# EAGLE design litebrite2.2 (EAGLE 6.5.0)
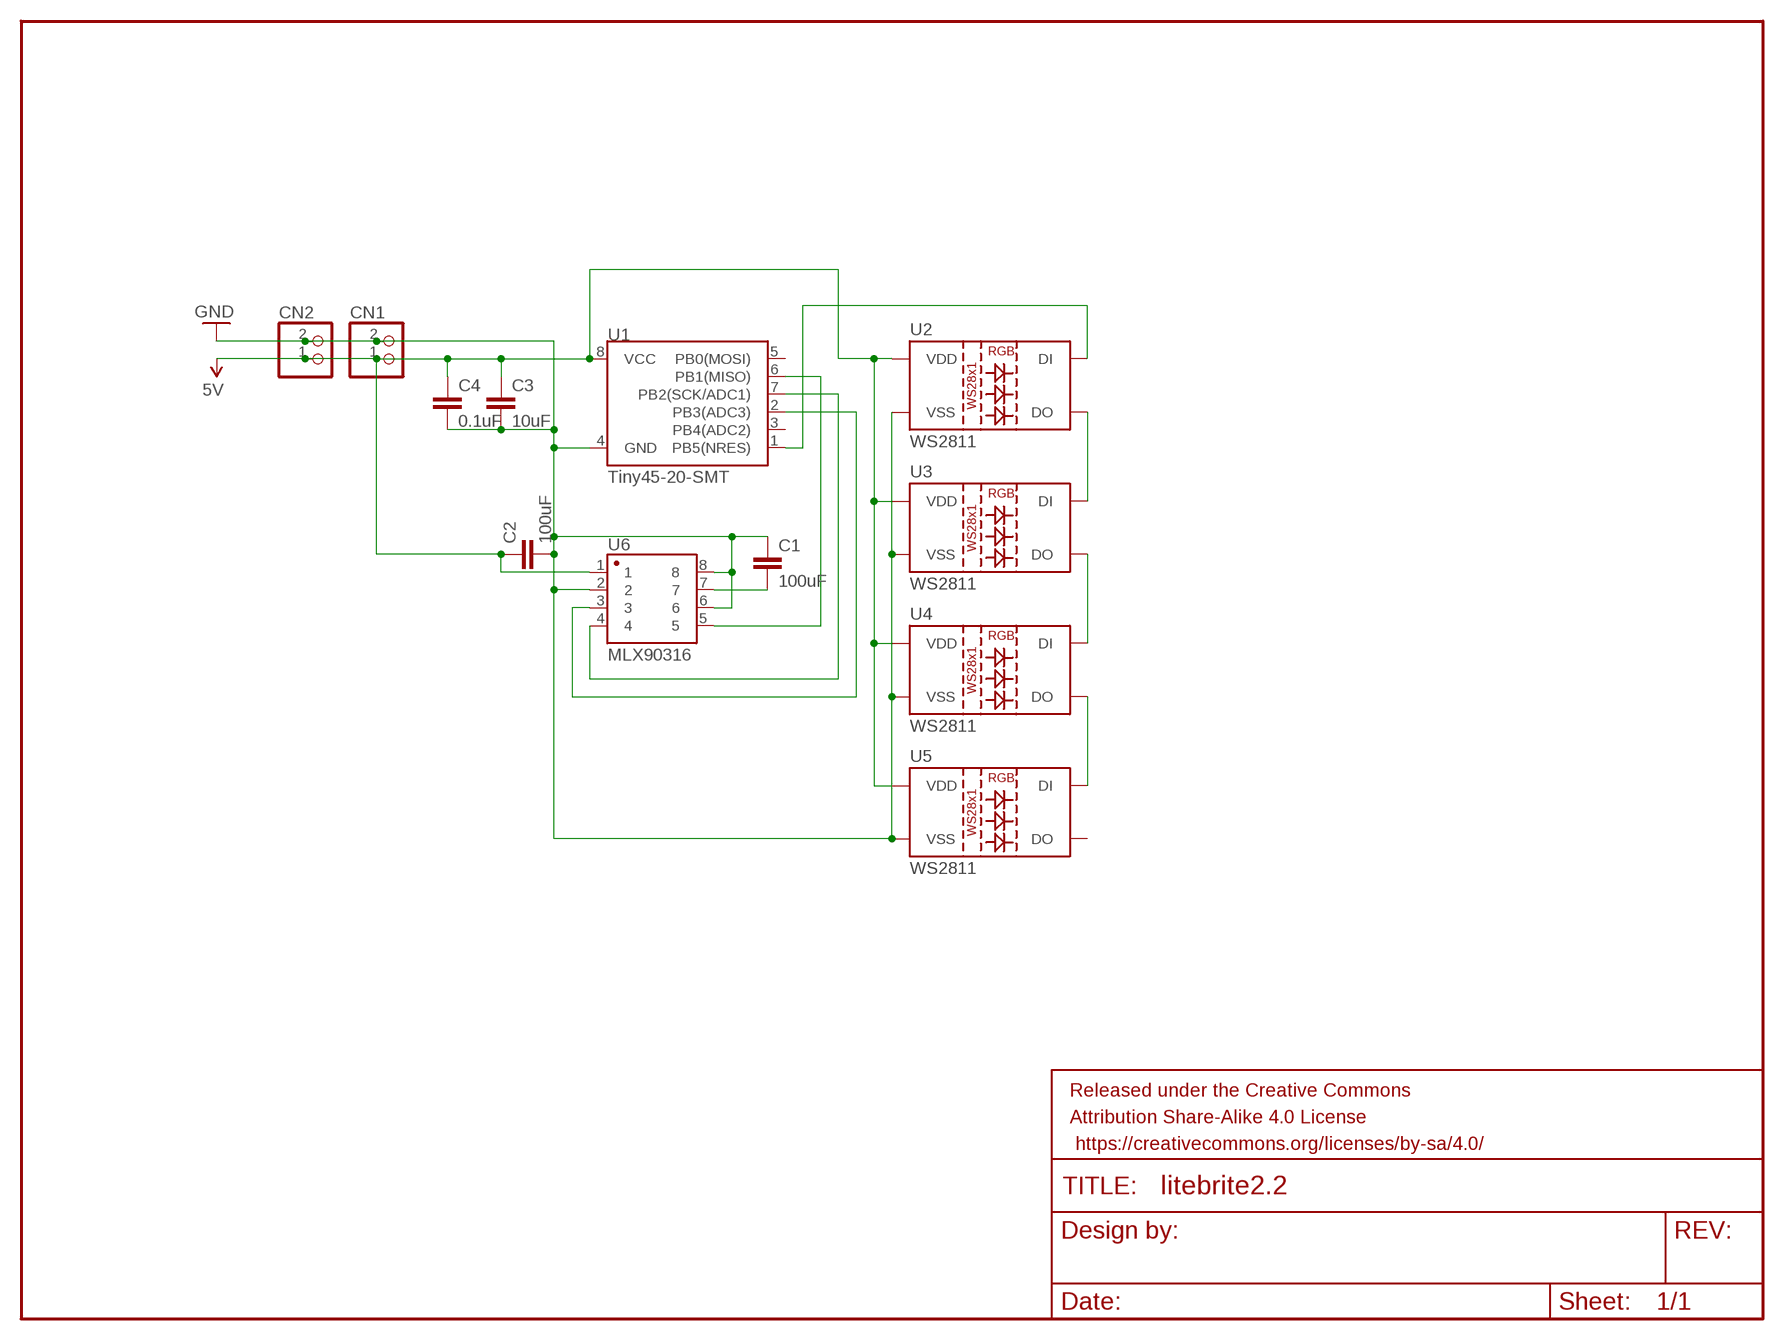
[diagram p0: schematic, sheet 1]

## Parts
C1  100uF  100UF6.3V20%(1210)  [1210]
C2  100uF  100UF6.3V20%(1210)  [1210]
C3  10uF  10UF-6.3V-20%(1206)  [1206]
C4  0.1uF  0.1UF-16V(+-10%)(0402)  [0402-CAP]
CN1  JST_2PIN-SMT-RA  [JST-PH-2-SMT-RA]
CN2  JST_2PIN-SMT-RA  [JST-PH-2-SMT-RA]
FRAME1  FRAME-LETTERNO_PACKAGE  [DUMMY]
U1  Tiny45-20-SMT  ATTINY45TINY45-20-SMT  [SO08-EIAJ]
U2  WS2811  LED-TRICOLOR-5050-ICWS2811  [LED-TRICOLOR-5050-IC]
U3  WS2811  LED-TRICOLOR-5050-ICWS2811  [LED-TRICOLOR-5050-IC]
U4  WS2811  LED-TRICOLOR-5050-ICWS2811  [LED-TRICOLOR-5050-IC]
U5  WS2811  LED-TRICOLOR-5050-ICWS2811  [LED-TRICOLOR-5050-IC]
U6  MLX90316  GENERIC-SOIC8MSGEQ7N-FILTER  [SO08]

## Nets
5V: C2.1 C3.1 C4.1 CN1.1 CN2.1 U1.8(VCC) U2.3(VDD) U2.5(VDD) U3.3(VDD) U3.5(VDD) U4.3(VDD) U4.5(VDD) U5.3(VDD) U5.5(VDD) U6.1
GND: C1.1 C2.2 C3.2 C4.2 CN1.2 CN2.2 U1.4(GND) U2.6(VSS) U3.6(VSS) U4.6(VSS) U5.6(VSS) U6.2 U6.6 U6.8
N$1: U2.1(DO) U3.2(DI)
N$2: U3.1(DO) U4.2(DI)
N$3: U4.1(DO) U5.2(DI)
N$4: U1.1(PB5(NRES)) U2.2(DI)
N$5: C1.2 U6.7
N$6: U1.6(PB1(MISO)) U6.5
N$7: U1.7(PB2(SCK/ADC1)) U6.4
N$8: U1.2(PB3(ADC3)) U6.3
Unconnected: U1.3(PB4(ADC2)) U1.5(PB0(MOSI)) U5.1(DO)

## Library data of the parts
C1 C2 = SparkFun-Capacitors:100UF6.3V20%(1210): CAP-09827; PROD_ID: CAP-09827
C3 = SparkFun-Capacitors:10UF-6.3V-20%(1206): CAP-10057 Ceramic; PROD_ID: CAP-10057
C4 = SparkFun-Capacitors:0.1UF-16V(+-10%)(0402); PROD_ID: CAP-12416
CN1 CN2 = adafruit:JST_2PIN: JST 2-Pin Connectors of various flavors SMT-RA (S2B-PH-SM4) 4UConnector #17311 SMT (B2B-PH-SM4) THM-RA (S2B-PH) THM (B2B-PH)
FRAME1 = SparkFun-Aesthetics:FRAME-LETTER: Schematic Frame Standard 8.5x11 US Letter frame; DESIGNER: Nobody; VERSION: v01
U1 = SparkFun-DigitalIC:ATTINY45: Atmel 8-pin 2/4/8kB flash uC; PROD_ID: IC-08922
U2-U5 = SparkFun-LED:LED-TRICOLOR-5050-IC: WS2812 RGB LED w/ WS2811 driver 5x5mm SMD LED with built-in controller IC. DIO-11598; PROD_ID: DIO-11598
U6 = SparkFun-AnalogIC:GENERIC-SOIC8: A placeholder for generic narrow & wide SOIC8 foorptints - used on the DIP adapter board.; PROD_ID: IC-10141

## Board
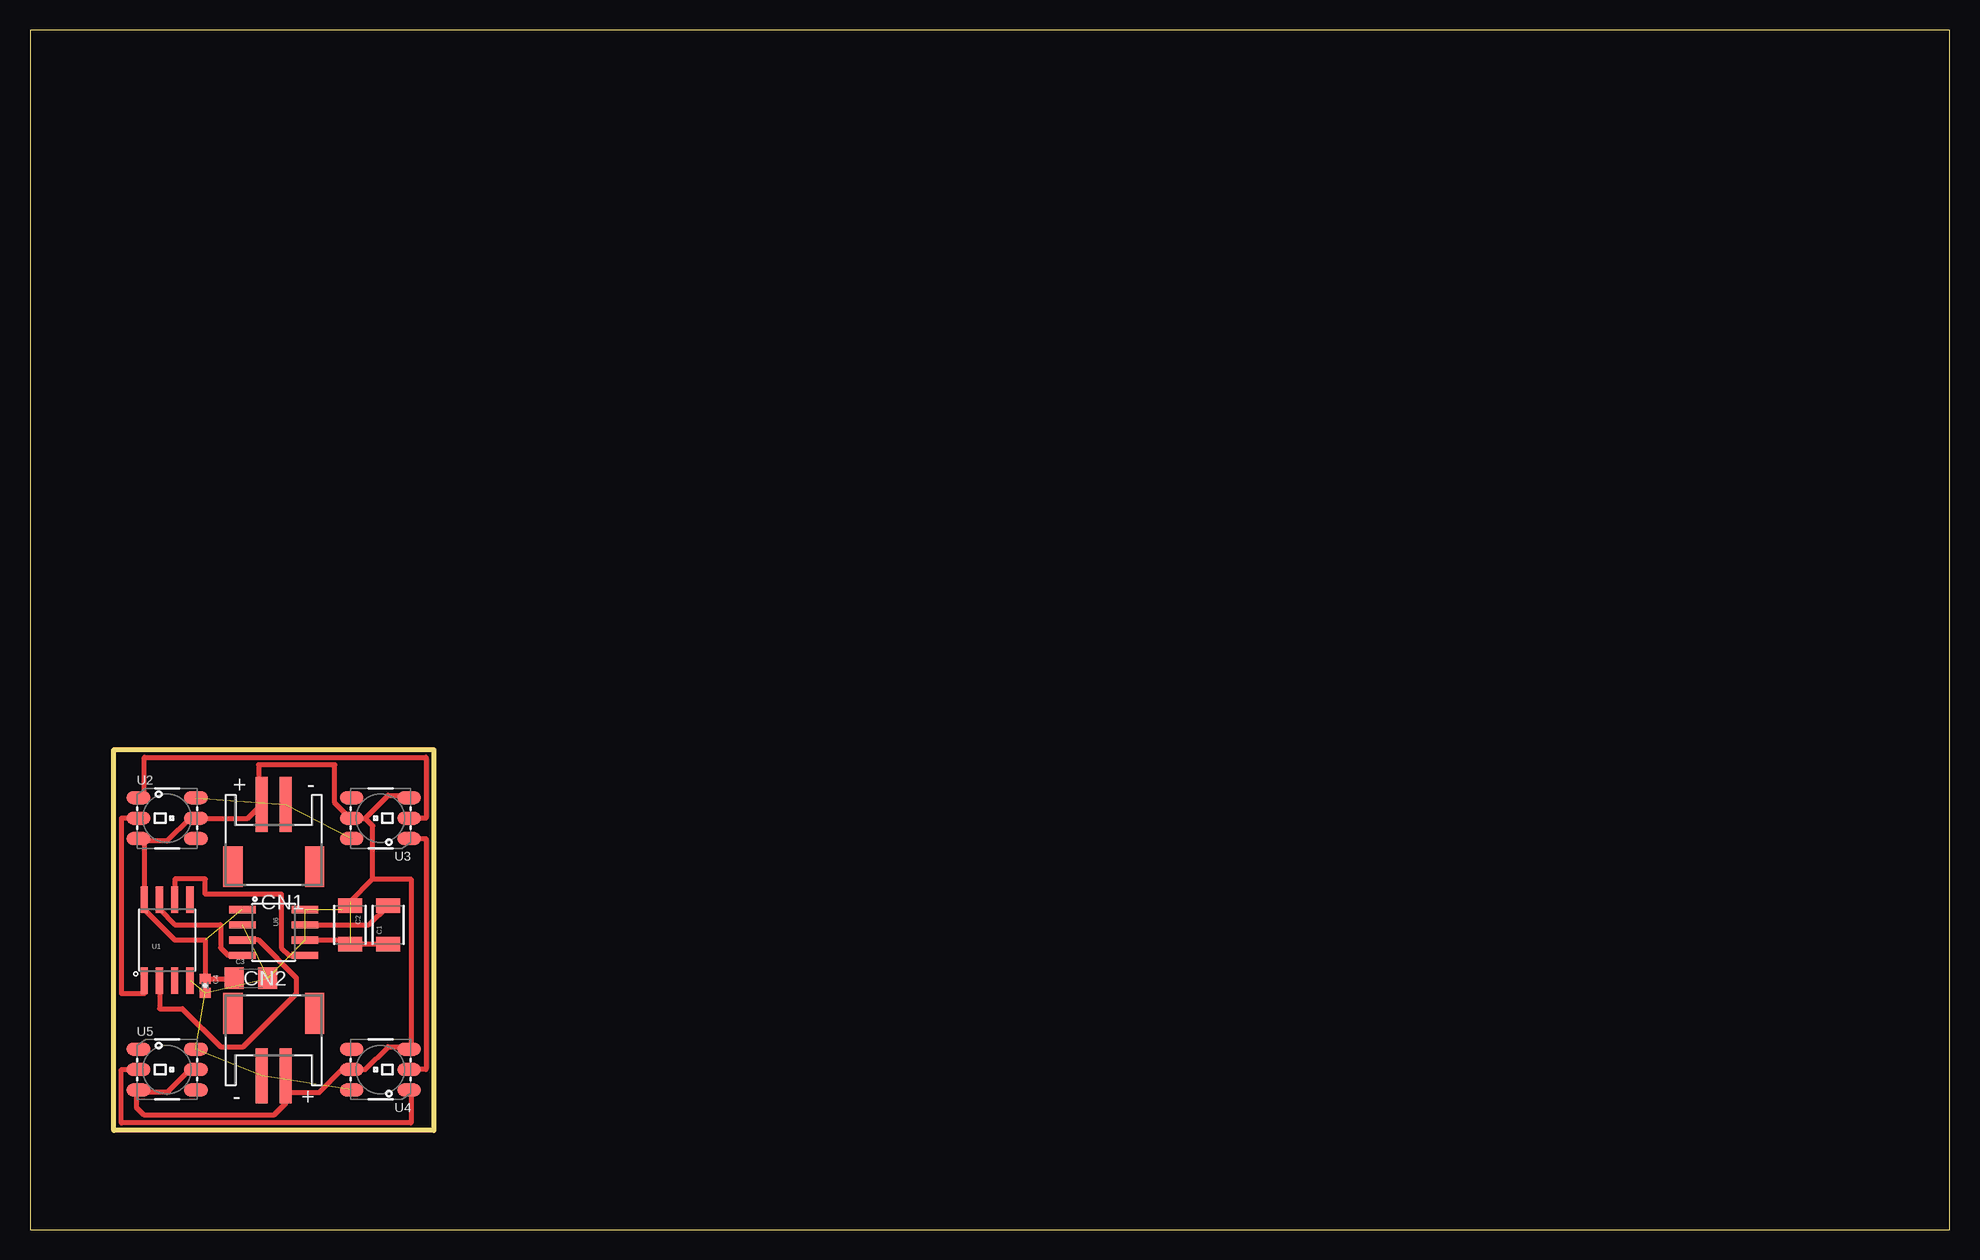
[diagram p1: board, top side]

Size 160 x 100 mm. Coordinates in mm from the lower left corner, seen from the top.
Outline: 0,0 160,0 160,100 0,100 0,0
Outline: 6.99,40.01 33.66,40.01 33.66,8.26 6.99,8.26 6.99,40.01
Copper layers (1*16): Top 0.035mm / dielectric 1.5mm / Bottom 0.035mm
Design rules "default": minimum track width 10mil, minimum drill 24mil, track to track 8mil, track to pad 8mil, pad to pad 8mil, via to via 8mil, smd to smd 8mil, copper to edge 40mil, drill to drill 8mil, minimum pad ring 10mil, minimum via ring 8mil, stop-mask expansion 4mil, vias tented up to drill 0mil, thermal gap 10mil

### Footprints (pad centres in the part's own frame; a part is rotated, then mirrored left to right if it is on the bottom)
1210 = smd 1.2 x 2: 1 -1.6,0; 2 1.6,0
1206 = smd 1.6 x 1.8: 1 -1.4,0; 2 1.4,0
0402-CAP = smd 0.85 x 0.9: 1 -0.58,0; 2 0.58,0
JST-PH-2-SMT-RA = smd 1 x 4.6: 1 1,-3.7; 2 -1,-3.7 | smd 1.6 x 3.4: NC1 -3.4,1.5; NC2 3.4,1.5
SO08-EIAJ = smd 0.61 x 2.21: 1 -1.905,-3.378; 2 -0.635,-3.378; 3 0.635,-3.378; 4 1.905,-3.378; 5 1.905,3.353; 6 0.635,3.353; 7 -0.635,3.353; 8 -1.905,3.353
LED-TRICOLOR-5050-IC = smd 2 x 1.1: 1 -2.4,1.7; 2 -2.4,0; 3 -2.4,-1.7; 4 2.4,-1.7; 5 2.4,0; 6 2.4,1.7
SO08 = smd 0.61 x 2.21: 1 -1.905,-2.616; 2 -0.635,-2.616; 3 0.635,-2.616; 4 1.905,-2.616; 5 1.905,2.616; 6 0.635,2.616; 7 -0.635,2.616; 8 -1.905,2.616

### Placement (x,y rotation side)
C1  29.84,25.4 90 top
C2  26.67,25.4 270 top
C3  18.41,20.95 0 top
C4  14.61,20.32 270 top
CN1  20.32,31.75 180 top
CN2  20.32,16.51 0 top
FRAME1  -13.97,31.75 0 top  (outside the outline)
U1  11.43,24.13 0 top
U2  11.43,34.29 0 top
U3  29.21,34.29 180 top
U4  29.21,13.34 180 top
U5  11.43,13.34 0 top
U6  20.32,24.77 270 top

### Tracks (layer width: path | path; a pad name or v marks a point on that pad's centre or on a via)
5V  (1 unrouted)
  Top 0.406: U2.3 9.53,32.59 9.53,32.38 | 9.53,32.38 U1.8 9.53,26.67 12.06,24.13 14.61,24.13 C4.1 16.96,20.9 C3.1 | U5.5 13.34,13.34 11.43,11.43 9.23,11.43 U5.3 8.89,11.49 8.89,10.16 9.53,9.53 20.32,9.53 21.32,10.53 CN2.1 21.32,11.7 21.59,11.43 24.13,11.43 26.04,13.34 U4.5 27.94,13.34 29.84,15.24 31.41,15.24 U4.3 31.75,15.18 31.75,29.21 28.57,29.21 | 9.53,32.38 11.43,32.38 13.34,34.29 U2.5 18.16,34.29 CN1.1 19.05,35.72 19.05,38.73 25.4,38.73 25.4,35.56 26.67,34.29 U3.5 27.94,34.29 | C2.1 26.67,27.3 28.57,29.21 | 28.57,29.21 28.57,33.66 27.94,34.29 | 27.94,34.29 29.84,36.2 31.41,36.2 U3.3
GND  (12 unrouted)
  Top 0.406: U6.6 26.34,24.13 C2.2 C1.1 | 26.04,26.67 26.67,27.3
N$1
  Top 0.406: U2.1 9.53,35.99 9.53,39.37 33.02,39.37 33.02,34.29 U3.2
N$2
  Top 0.406: U3.1 33.02,32.59 33.02,13.34 U4.2
N$3
  Top 0.406: U4.1 31.75,11.63 31.75,8.89 7.62,8.89 7.62,13.34 U5.2
N$4
  Top 0.406: U2.2 7.62,34.29 7.62,19.68 9.53,19.68 U1.1
N$5
  Top 0.406: U6.7 28.25,25.4 C1.2
N$6
  Top 0.406: U1.6 12.06,29.21 14.61,29.21 14.61,27.94 20.95,27.94 20.95,23.5 21.59,22.86 U6.5
N$7
  Top 0.406: U1.7 10.79,26.67 12.06,25.4 15.88,25.4 15.88,23.5 16.51,22.86 U6.4
N$8
  Top 0.406: U1.2 10.79,18.41 12.7,18.41 15.88,15.24 17.78,15.24 22.23,19.68 22.23,20.95 19.05,24.13 U6.3